# EAGLE schematic Moty Light (EAGLE 7.2.0)
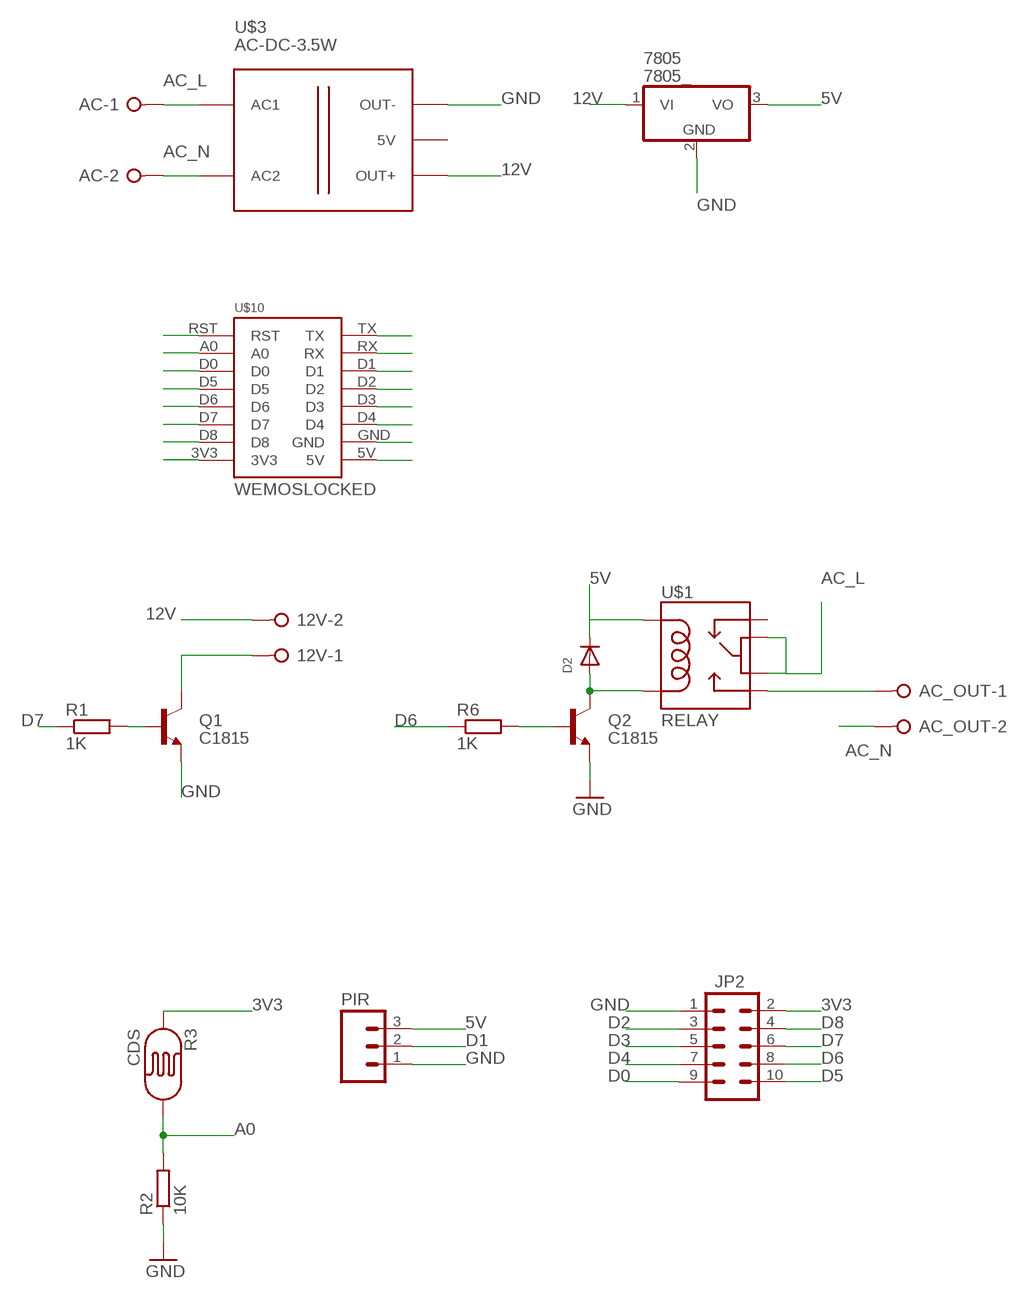
[diagram p0: schematic, sheet 1]

## Parts
12V  W237-02P  [W237-132]
7805  7805_  7805TV  [TO220V]
AC  W237-02P  [W237-132]
AC_OUT  W237-02P  [W237-132]
D2  DIODESMA  [SMADIODE]
JP2  M05X2PTH  [AVR_ICSP]
PIR  M03PTH  [1X03]
Q1  C1815  TRANSISTOR_NPNMMBT2222A  [SOT23-3]
Q2  C1815  TRANSISTOR_NPNMMBT2222A  [SOT23-3]
R1  1K  R-EU_R0805  [R0805]
R2  10K  R-EU_R0805  [R0805]
R3  CDS  PHOTOCELL  [PHOTOCELL_THIN]
R6  1K  R-EU_R0805  [R0805]
U$1  RELAY  MINIATURE_RELAY_JRC_21F  [MINIATURE_RELAY_JRC_21F]
U$3  AC-DC-3.5W  [AC-DC-3.5W]
U$10  WEMOSLOCKED  [WEMOS_LOCKED]

## Nets
3V3: JP2.2 R3.1 U$10.3V3
5V: 7805.3(VO) D2.C PIR.3 U$1.COIL1 U$10.5V
12V: 12V.2 7805.1(VI) U$3.J2.3(OUT+)
A0: R2.2 R3.2 U$10.A0
AC_L: AC.1 U$1.COM1 U$1.COM2 U$3.J1.1(AC1)
AC_N: AC.2 AC_OUT.2 U$3.J1.2(AC2)
D0: JP2.9 U$10.D0
D1: PIR.2 U$10.D1
D2: JP2.3 U$10.D2
D3: JP2.5 U$10.D3
D4: JP2.7 U$10.D4
D5: JP2.10 U$10.D5
D6: JP2.8 R6.1 U$10.D6
D7: JP2.6 R1.1 U$10.D7
D8: JP2.4 U$10.D8
GND: 7805.2(GND) JP2.1 PIR.1 Q1.2(E) Q2.2(E) R2.1 U$3.J2.1(OUT-) U$10.GND
N$1: 12V.1 Q1.3(C)
N$3: D2.A Q2.3(C) U$1.COIL2
N$4: Q2.1(B) R6.2
N$7: Q1.1(B) R1.2
N$8: AC_OUT.1 U$1.NO
RST: U$10.RST
RX: U$10.RX
TX: U$10.TX
Unconnected: U$1.NC U$3.J2.2(5V)

## Library data of the parts
12V AC AC_OUT = con-wago-508:W237-02P: WAGO SREW CLAMP; OC_FARNELL: unknown; OC_NEWARK: unknown
7805 = linear:78*: Positive VOLTAGE REGULATOR Source: http://cache.national.com/ds/LM/LM78L05.pdf http://www.fairchildsemi.com/ds/LM/LM7805.pdf
D2 = adafruit:DIODE: Diode SMADIODE - SMA Surface Mount Package 20V 1A Schottky Diode Digikey: 641-1014-6-ND DO-1N4148 - Through Hole Small Current Diode SOD-123 20V 1 A (.5mV Vf) Schottky Diode - Digikey: MBRX120TPMSCT-ND SOD-323 10V 570mA (.38mV Vf, 3ns) Schottky Diode - Digikey: ZLLS410CT-ND SOD-523 30V 30mA Schottky Diode (RB751S-40TE61) - Digikey: RB751S-40TE61CT-ND SOT23-R/W - SOT23 Package (R = Solder Paste/Reflow Ovens, W = Hand-Soldering) BAT54Film 40V 300mA - Digikey: 497-7162-1-ND
JP2 = SparkFun-Connectors:M05X2: Header 5x2 Standard 10-pin dual row 0.1" header. Commonly used with AVR-ISP. Use with Spark Fun Electronics SKU: PRT-00778
PIR = SparkFun-Connectors:M03: Header 3 Standard 3-pin 0.1" header. Use with straight break away headers (SKU : PRT-00116), right angle break away headers (PRT-00553), swiss pins (PRT-00743), machine pins (PRT-00117), and female headers (PRT-00115). Molex polarized connector foot print use with SKU : PRT-08232 with associated crimp pins and housings.
Q1 Q2 = SparkFun-DiscreteSemi:TRANSISTOR_NPN: Generic NPN BJT MMBT2222A - TRANS-08049 (SOT-23, 1A 40V) MPSA42 - TRANS-09116 (SOT-23, 500mA 300V) MMBT5088LT1G - TRANS-11160 (SOT-23, 50 mA 30V) BC547 - COM-08928 <http://www.sparkfun.com/products/8928> (TO-92 45V 100mA) (1.Collector 2.Base 3.Emitter) 2N3904 - COM-00521 <http://www.sparkfun.com/products/521> (TO-92 40V 200mA) (1.Emitter 2.Base 3.Collector) P2N2222A - COM-12852 <http://www.sparkfun.com/products/12852> (TO-92 40V 600mA) (1.Collector 2.Base 3.Emitter); PROD_ID: TRANS-08049; VALUE: MMBT2222A
R1 R2 R6 = rcl:R-EU_: RESISTOR, European symbol
R3 = SparkFun-Sensors:PHOTOCELL: CdS photoresistor. This is a low cost way to detect light levels. Resistance decreases with more incoming light. SparkFun SKU: SEN-09088
U$1 = My Eagle Lib:MINIATURE_RELAY_JRC_21F
U$3 = diy-modules:AC-DC-3.5W: AC/DC 3.5W Converter
U$10 = My Eagle Lib:WEMOS